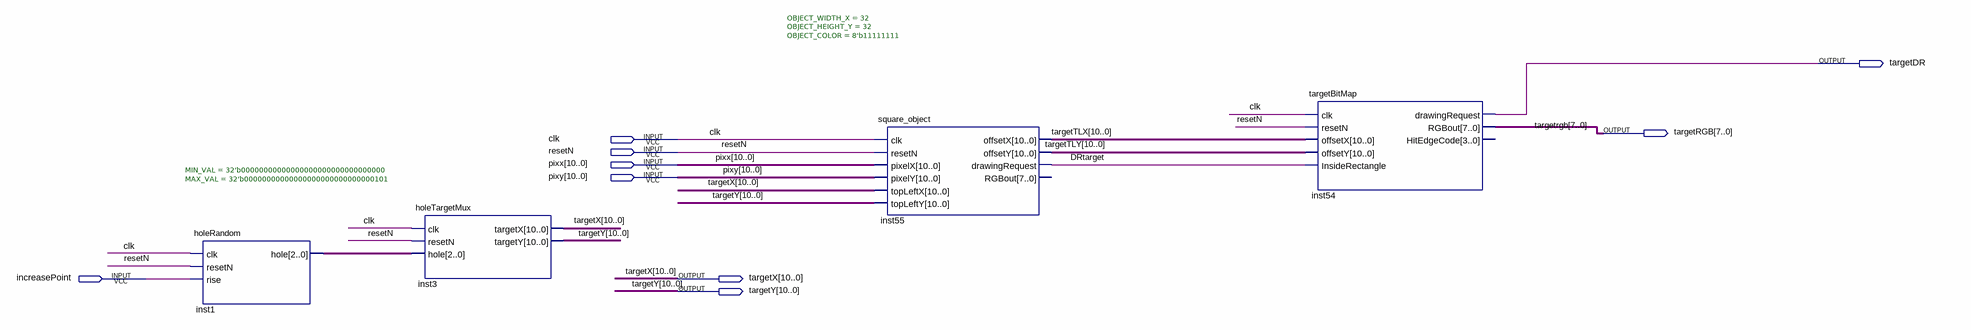
[diagram p0: schematic sheet]
// Quartus schematic targetDisplay.bdf as structural Verilog: 4 symbols, 9 pins
module targetDisplay (
  input  clk,
  input  resetN,
  input  [10:0] pixx,
  input  [10:0] pixy,
  input  increasePoint,
  output targetDR,
  output [7:0] targetRGB,
  output [10:0] targetX,
  output [10:0] targetY
);

  wire DRtarget;
  wire [2:0] inst1_hole;
  wire [10:0] targetTLX, targetTLY;

  holeRandom #(.MIN_VAL(32'b00000000000000000000000000000000), .MAX_VAL(32'b00000000000000000000000000000101)) inst1 (
    .clk(clk), .resetN(resetN), .rise(increasePoint), .hole(inst1_hole));
  holeTargetMux inst3 (.clk(clk), .resetN(resetN), .hole(inst1_hole), .targetX(targetX), .targetY(targetY));
  square_object #(.OBJECT_WIDTH_X(32), .OBJECT_HEIGHT_Y(32), .OBJECT_COLOR(8'b11111111)) inst55 (
    .clk(clk), .resetN(resetN), .pixelX(pixx), .pixelY(pixy), .topLeftX(targetX), .topLeftY(targetY),
    .offsetX(targetTLX), .offsetY(targetTLY), .drawingRequest(DRtarget));  // open: RGBout
  targetBitMap inst54 (
    .clk(clk), .resetN(resetN), .offsetX(targetTLX), .offsetY(targetTLY), .InsideRectangle(DRtarget),
    .drawingRequest(targetDR), .RGBout(targetRGB));  // open: HitEdgeCode
endmodule
